# Altium schematic sheet sch3.SchDoc
size 420 x 297 mm; Address1: Address1; Address2: Address2; Address3: Address3; Address4: Address4; DocumentNumber: АБВГ.123456.001 Э3; SheetNumber: 1; Scale: 1:1; DocumentType: Схема электрическая принципиальная; FirstReferrence: АБВГ.123456.001
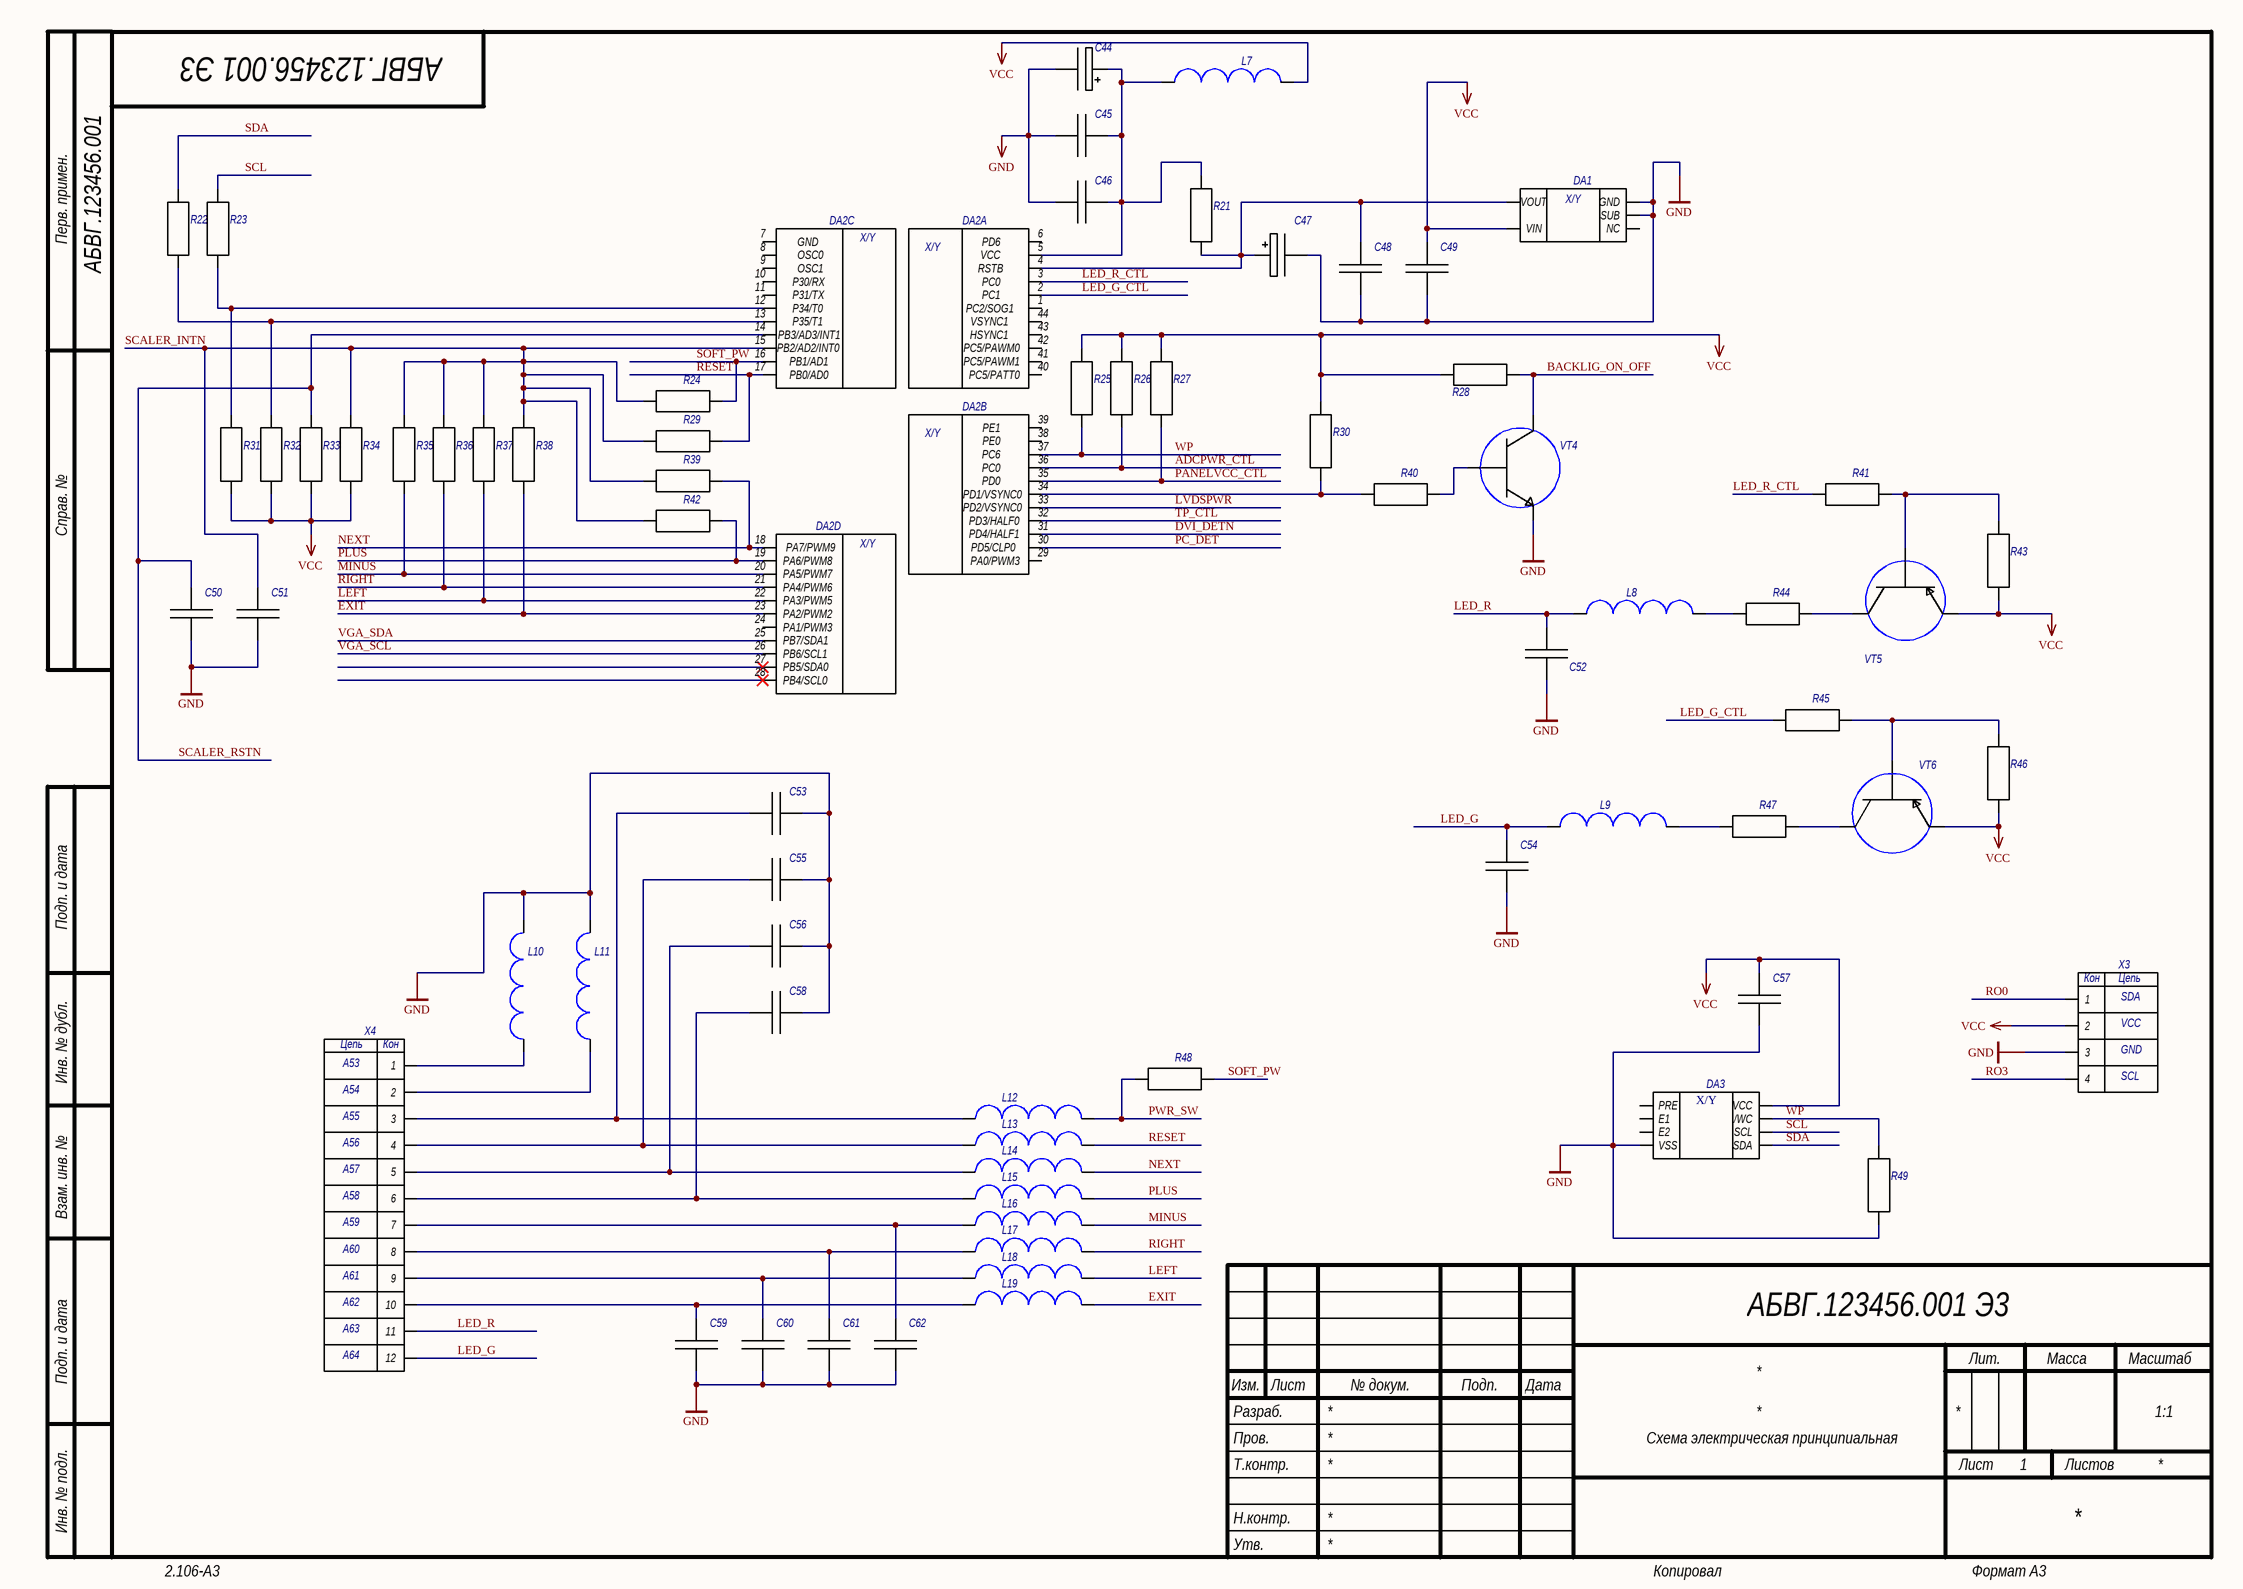
[diagram p0: sch3.SchDoc]

## Parts
C44  *  [Capacitor 0805]  (value not drawn)
C45  *  [Capacitor 0805]  (value not drawn)
C46  *  [Capacitor 0805]  (value not drawn)
C47  *  [Capacitor 0805]  (value not drawn)
C48  *  [Capacitor 0805]  (value not drawn)
C49  *  [Capacitor 0805]  (value not drawn)
C50  *  [Capacitor 0805]  (value not drawn)
C51  *  [Capacitor 0805]  (value not drawn)
C52  *  [Capacitor 0805]  (value not drawn)
C53  *  [Capacitor 0805]  (value not drawn)
C54  *  [Capacitor 0805]  (value not drawn)
C55  *  [Capacitor 0805]  (value not drawn)
C56  *  [Capacitor 0805]  (value not drawn)
C57  *  [Capacitor 0805]  (value not drawn)
C58  *  [Capacitor 0805]  (value not drawn)
C59  *  [Capacitor 0805]  (value not drawn)
C60  *  [Capacitor 0805]  (value not drawn)
C61  *  [Capacitor 0805]  (value not drawn)
C62  *  [Capacitor 0805]  (value not drawn)
DA1  IC103  [IC103_2]  (value not drawn)
DA2  *  [NT68]  (value not drawn)  (parts A,B,C,D of 4)
DA3  *  [IC102]  (value not drawn)
L7  *  [Inductor 2520]  (value not drawn)
L8  *  [Inductor 2520]  (value not drawn)
L9  *  [Inductor 2520]  (value not drawn)
L10  *  [Inductor 2520]  (value not drawn)
L11  *  [Inductor 2520]  (value not drawn)
L12  *  [Inductor 2520]  (value not drawn)
L13  *  [Inductor 2520]  (value not drawn)
L14  *  [Inductor 2520]  (value not drawn)
L15  *  [Inductor 2520]  (value not drawn)
L16  *  [Inductor 2520]  (value not drawn)
L17  *  [Inductor 2520]  (value not drawn)
L18  *  [Inductor 2520]  (value not drawn)
L19  *  [Inductor 2520]  (value not drawn)
R21  *  [Resistor 1206]  (value not drawn)
R22  *  [Resistor 1206]  (value not drawn)
R23  *  [Resistor 1206]  (value not drawn)
R24  *  [Resistor 1206]  (value not drawn)
R25  *  [Resistor 1206]  (value not drawn)
R26  *  [Resistor 1206]  (value not drawn)
R27  *  [Resistor 1206]  (value not drawn)
R28  *  [Resistor 1206]  (value not drawn)
R29  *  [Resistor 1206]  (value not drawn)
R30  *  [Resistor 1206]  (value not drawn)
R31  *  [Resistor 1206]  (value not drawn)
R32  *  [Resistor 1206]  (value not drawn)
R33  *  [Resistor 1206]  (value not drawn)
R34  *  [Resistor 1206]  (value not drawn)
R35  *  [Resistor 1206]  (value not drawn)
R36  *  [Resistor 1206]  (value not drawn)
R37  *  [Resistor 1206]  (value not drawn)
R38  *  [Resistor 1206]  (value not drawn)
R39  *  [Resistor 1206]  (value not drawn)
R40  *  [Resistor 1206]  (value not drawn)
R41  *  [Resistor 1206]  (value not drawn)
R42  *  [Resistor 1206]  (value not drawn)
R43  *  [Resistor 1206]  (value not drawn)
R44  *  [Resistor 1206]  (value not drawn)
R45  *  [Resistor 1206]  (value not drawn)
R46  *  [Resistor 1206]  (value not drawn)
R47  *  [Resistor 1206]  (value not drawn)
R48  *  [Resistor 1206]  (value not drawn)
R49  *  [Resistor 1206]  (value not drawn)
VT4  *  [Transistor 1]  (value not drawn)
VT5  *  [Transistor 1]  (value not drawn)
VT6  *  [Transistor 1]  (value not drawn)
X3  *  [BUSES]  (value not drawn)
X4  *  [J101]  (value not drawn)

## Nets
GND: C44.1 C45.2 C46.2 C47.1 C48.2 C49.2 C50.1 C51.1 C52.1 C53.1 C54.1 C55.1 C56.1 C57.1 C58.1 C59.1 C60.1 C61.1 C62.1 DA1.1(GND) DA1.2(SUB) DA3.4(VSS) L10.2 L11.2 R49.1 VT4.1(KOLLECTOR) X3.3
VCC: C49.1 C57.2 DA1.5(VIN) DA3.5(VCC) L7.2 R25.2 R26.2 R27.2 R28.1 R30.2 R31.1 R32.1 R33.1 R34.1 R43.1 R46.1 VT5.2(EMITTER) VT6.2(EMITTER) X3.2
ADCPWR_CTL: DA2.36(PC0) R26.1
BACKLIG_ON_OFF: R28.2 VT4.2(EMITTER)
DVI_DETN: DA2.31(PD4/HALF1)
EXIT: DA2.23(PA2/PWM2) L19.2 R38.1
LED_G: C54.2 L9.1 X4.12
LED_G_CTL: DA2.2(PC1) R45.1
LED_R: C52.2 L8.1 X4.11
LED_R_CTL: DA2.3(PC0) R41.1
LEFT: DA2.22(PA3/PWM5) L18.2 R37.1
LVDSPWR: DA2.33(PD2/VSYNC0)
MINUS: DA2.20(PA5/PWM7) L16.2 R35.1
NEXT: DA2.18(PA7/PWM9) L14.2 R39.2
PANELVCC_CTL: DA2.35(PD0) R27.1
PC_DET: DA2.30(PD5/CLP0)
PLUS: DA2.19(PA6/PWM8) L15.2 R42.2
PWR_SW: L12.2 R48.1
RESET: DA2.17(PB0/AD0) L13.2 R29.2
RIGHT: DA2.21(PA4/PWM6) L17.2 R36.1
RO0: X3.1
RO3: X3.4
SCALER_INTN: C51.2 DA2.15(PB2/AD2/INT0) R24.1 R29.1 R34.2 R35.2 R36.2 R37.2 R38.2 R39.1 R42.1
SCALER_RSTN: C50.2 DA2.14(PB3/AD3/INT1) R33.2
SCL: DA3.7(SCL) R23.2
SDA: DA3.8(SDA) R22.2
SOFT_PW: DA2.16(PB1/AD1) R24.2 R48.2
TP_CTL: DA2.32(PD3/HALF0)
VGA_SCL: DA2.26(PB6/SCL1)
VGA_SDA: DA2.25(PB7/SDA1)
WP: DA2.37(PC6) DA3.6(/WC) R25.1 R49.2
NetC44_2: C44.2 C45.1 C46.1 DA2.5(VCC) L7.1 R21.2
NetC47_2: C47.2 C48.1 DA1.4(VOUT) DA2.4(RSTB) R21.1
NetC53_2: C53.2 L12.1 X4.3
NetC55_2: C55.2 L13.1 X4.4
NetC56_2: C56.2 L14.1 X4.5
NetC58_2: C58.2 L15.1 X4.6
NetC59_2: C59.2 L19.1 X4.10
NetC60_2: C60.2 L18.1 X4.9
NetC61_2: C61.2 L17.1 X4.8
NetC62_2: C62.2 L16.1 X4.7
NetDA2_12: DA2.12(P34/T0) R23.1 R31.2
NetDA2_13: DA2.13(P35/T1) R22.1 R32.2
NetDA2_34: DA2.34(PD1/VSYNC0) R30.1 R40.1
NetL8_2: L8.2 R44.1
NetL9_2: L9.2 R47.1
NetL10_1: L10.1 X4.1
NetL11_1: L11.1 X4.2
NetR40_2: R40.2 VT4.3(BAZA)
NetR41_2: R41.2 R43.2 VT5.3(BAZA)
NetR44_2: R44.2 VT5.1(KOLLECTOR)
NetR45_2: R45.2 R46.2 VT6.3(BAZA)
NetR47_2: R47.2 VT6.1(KOLLECTOR)

Not connected (* = marked no-connect by the designer): DA1 3(NC); DA2 1(PC2/SOG1) 6(PD6) 7(GND) 8(OSC0) 9(OSC1) 10(P30/RX) 11(P31/TX) 24(PA1/PWM3) 27(PB5/SDA0)* 28(PB4/SCL0)* 29(PA0/PWM3) 38(PE0) 39(PE1) 40(PC5/PATT0) 41(PC5/PAWM1) 42(PC5/PAWM0) 43(HSYNC1) 44(VSYNC1); DA3 1(PRE) 2(E1) 3(E2)

## Notes on the sheet
- Перв. примен.
- Справ. №
- Подп. и дата
- Инв. № дубл.
- Взам. инв. №
- Разраб.
- Изм.
- Лист
- № докум.
- Подп.
- Дата
- Лит.
- Масса
- Масштаб
- Пров.
- Т.контр.
- Листов
- Инв. № подл.
- Утв.
- Н.контр.
- 2.106-A3
- Копировал
- Формат А3
- (in symbol IC102) X/Y
- (in symbol IC103) X/Y
- (in symbol J101) Цепь; Кон; A53; A54; A55; A56; A57; A58; A59; A60; A61; A62; A63; A64
- (in symbol J102) Кон; Цепь; SDA; VCC; GND; SCL
- (in symbol NT68, part A) X/Y
- (in symbol NT68, part B) X/Y
- (in symbol NT68, part C) X/Y
- (in symbol NT68, part D) X/Y

## Library data of the parts
C44 C47 = Capacitor Duga: Model: *
C45 C46 C48-C62 = Capacitor: Model: *
DA2 = NT68
DA3 = IC102
L7-L19 = Inductor: Model: *
R21-R49 = Resistor: Model: *
VT4 = Transistor 1
VT5 VT6 = Transistor 2
X3 = J102
X4 = J101